# Altium schematic sheet TemperatureSensor.SchDoc: Sensor de Temperatura
size A4; ENG_APP_DATE: --/--/--; DSN_APP_DATE: --/--/--; CHK_APP_DATE: --/--/--; Date: *******; ApprovedBy: *******; CheckedBy: None; Author: *******; CompanyName: *******; DrawnBy: Name; Engineer: *******; Organization: *******; Address1: *******; Address2: *******; Address3: *******; Address4: *******; DocumentNumber: Doc Num; Revision: *******; SheetNumber: 4; SheetTotal: 7; CurrentTime: *******; CurrentDate: *******; Time: *******; DocumentFullPathAndName: *******; DocumentName: *******; ModifiedDate: *******; ImagePath: *******; ProjectName: *******; Application_BuildNumber: *******
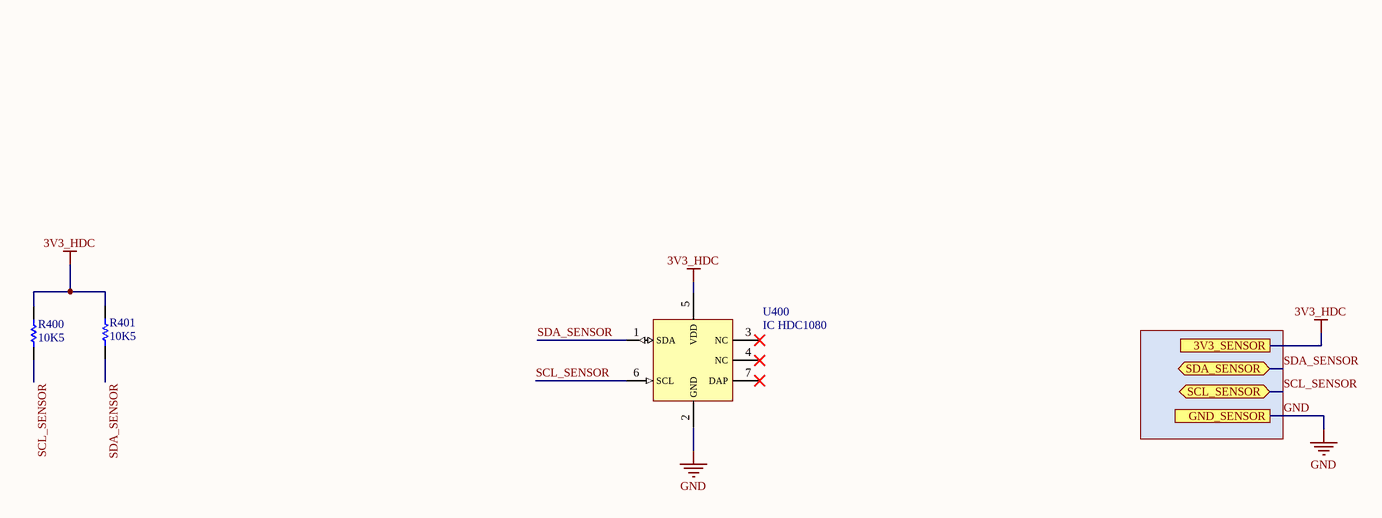
[diagram p0: TemperatureSensor.SchDoc]

## Parts
R400  10K5  [CR2012-0805]
R401  10K5  [CR2012-0805]
U400  IC HDC1080  [PSON100P300X80_HS-7N]

## Ports
3V3_SENSOR, GND_SENSOR, SCL_SENSOR (bidir), SDA_SENSOR (bidir)

## Nets
3V3_HDC: R400.2 R401.2 U400.5(VDD) ; port 3V3_SENSOR
GND: U400.2(GND) ; port GND_SENSOR
SCL_SENSOR: R400.1 U400.6(SCL) ; port SCL_SENSOR
SDA_SENSOR: R401.1 U400.1(SDA) ; port SDA_SENSOR

Not connected (* = marked no-connect by the designer): U400 3(NC)* 4(NC)* 7(DAP)*

## Notes on the sheet
- Title:
- Drawn By:
- Page Contents:
- Checked By:
- Size:
- Date:
- File:
- License:
- Email:
- A4
- Number:
- Time:
- Revision:
- Sheet
- Website:
- of

## Library data of the parts
R400 R401 = CMP-018-000099-1: RES SMD 10.5K OHM 0.1% 1/8W 0805; Manufacturer: Panasonic Electronic Components; Manufacturer Part Number: ERA-6AEB1052V; Power (Watts): 0.125W, 1/8W; Temperature Coefficient: ±25ppm/°C; Tolerance: ±0.1%; Part Status: Active; Design Item ID: RES 10K5 OHM 0.1% 1/8W 0805 SMD; Height: 0.024" (0.60mm); Packaging: Cut Tape (CT); Source: mits.SchLib; Number of Terminations: 2; Resistance (Ohms): 10.5k; Stock 1: 1614; Supplier Device Package: 0805; Category: Resistors; Size / Dimension: 0.079" L x 0.049" W (2.00mm x 1.25mm); RoHS: RoHS Compliant; Pricing 1: 1=0.63, 50=0.2494, 100=0.1924, 250=0.14964, 500=0.10546, 1000=0.07695 (USD); Features: Automotive AEC-Q200; Composition: Thin Film; Package / Case: 0805 (2012 Metric); ComponentLink1URL: http://media.digikey.com/pdf/Data%20Sheets/Panasonic%20Electronic%20Components/ERA%201A,2A,3A,6A,8A.pdf; Operating Temperature: -55°C ~ 155°C; ComponentLink1Description: http://media.digikey.com/pdf/Data%20Sheets/Panasonic%20Electronic%20Components/ERA%201A,2A,3A,6A,8A.pdf
U400 = CMP-023-000042-1: SENSOR HUMI/TEMP 3.3V I2C 4% SMD; Manufacturer 1: Texas Instruments; Manufacturer Part Number 1: HDC1080DMBR; Sensor Type: Temperature; Max Supply Voltage: 5.5V; Response Time: 15s; Accuracy: 2%; Output Type: I2C,Voltage; Min Supply Voltage: 2.7V; ComponentLink2URL: http://www.ti.com/general/docs/suppproductinfo.tsp?distId=10&amp;gotoUrl=http%3A%2F%2Fwww.ti.com%2Flit%2Fgpn%2Fhdc1080&src-supplier=Digi-Key; Interface: I2C; ComponentLink2Description: http://www.ti.com/general/docs/suppproductinfo.tsp?distId=10&amp;gotoUrl=http%3A%2F%2Fwww.ti.com%2Flit%2Fgpn%2Fhdc1080&src-supplier=Digi-Key; Lead Free: Lead Free; ComponentLink1URL: http://www.ti.com/lit/ds/symlink/hdc1080.pdf?src-supplier=Digi-Key; Category: Integrated Circuits (ICs); Mount: Surface Mount; RoHS: Yes; Contact Plating: Gold; Design Item ID: IC HDC1080 TEMP/HUMID SENSOR 6-PWSON; Source: mits.SchLib; ComponentLink3Description: http://www.ti.com/lit/ds/symlink/hdc1080.pdf?src-supplier=Avnet+Asia; ComponentLink3URL: http://www.ti.com/lit/ds/symlink/hdc1080.pdf?src-supplier=Avnet+Asia; ComponentLink1Description: http://www.ti.com/lit/ds/symlink/hdc1080.pdf?src-supplier=Digi-Key; Max Operating Temperature: 125°C; Min Operating Temperature: -40°C; Stock 1: 72; Pricing 1: 1=2,81800, 10=2,40190, 30=2,29790, 100=2,16440, 500=2,10100, 1000=2,08970, 1=2,69760, 10=2,29930, 30=2,19960, 100=2,07190, 500=2,01120, 1000=2,00040, 1=14,08600, 10=12,00600, 30=11,48590, 100=10,81860, 500=10,50210, 1000=10,44560, 1=13,56590, 10=11,56280, 30=11,06190, 100=10,41920, 500=10,11440, 1000=10,06000, 1=1,82390, 10=1,55460, 30=1,48720, 100=1,40080, 500=1,35990, 1000=1,35250, 1=1,55080, 10=1,32180, 30=1,26460, 100=1,19110, 500=1,15630, 1000=1,15000, 1=16,67800, 10=14,21530, 30=13,59950, 100=12,80940, 500=12,43460, 1000=12,36770, 1=237,44120, 10=202,38070, 30=193,61280, 100=182,36520, 500=177,02920, 1000=176,07710, 1=8,88030, 10=7,56900, 30=7,24110, 100=6,82040, 500=6,62090, 1000=6,58530, 1=163,93950, 10=139,73230, 30=133,67860, 100=125,91270, 500=122,22850, 1000=121,57110, 1=18,70970, 10=15,94710, 30=15,25620, 100=14,36990, 500=13,94940, 1000=13,87440, 1=2,88620, 10=2,46000, 30=2,35340, 100=2,21670, 500=2,15180, 1000=2,14030, 1=2,14480, 10=1,82810, 30=1,74890, 100=1,64730, 500=1,59910, 1000=1,59050 (AUD); RoHS Compliant: Yes